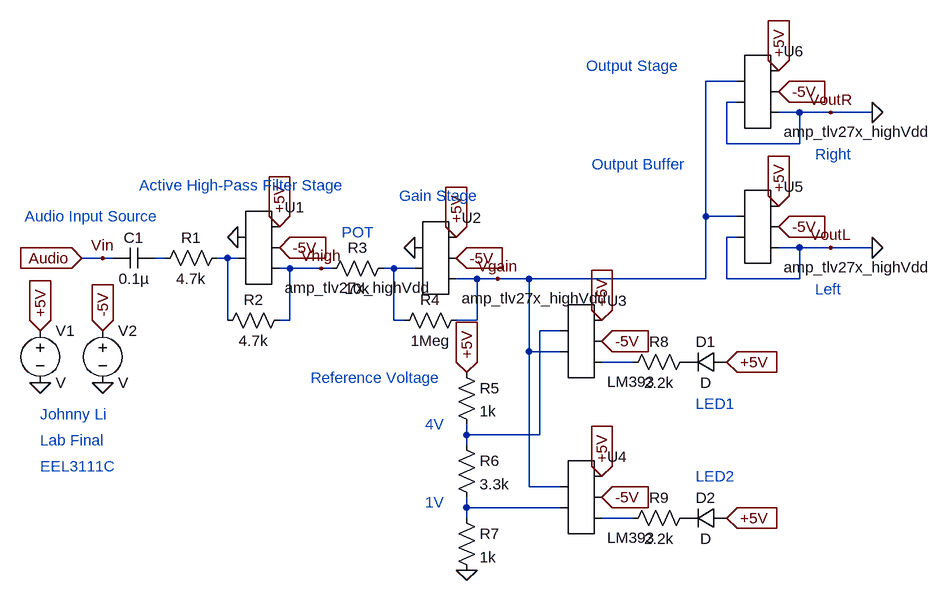
[diagram p0: schematic Lab Final.asc]
Lab Final.asc, the LTspice schematic file:
Version 4
SHEET 1 1588 680
WIRE 944 -192 896 -192
WIRE 944 -160 928 -160
WIRE 1040 -144 1008 -144
WIRE 1088 -144 1040 -144
WIRE 1152 -144 1088 -144
WIRE 928 -96 928 -160
WIRE 1040 -96 1040 -144
WIRE 1040 -96 928 -96
WIRE 896 16 896 -192
WIRE 944 16 896 16
WIRE 944 48 928 48
WIRE 1040 64 1008 64
WIRE 1088 64 1040 64
WIRE 1152 64 1088 64
WIRE -32 80 -64 80
WIRE -16 80 -32 80
WIRE 64 80 48 80
WIRE 160 80 144 80
WIRE 176 80 160 80
WIRE 256 96 240 96
WIRE 304 96 256 96
WIRE 320 96 304 96
WIRE 416 96 400 96
WIRE 448 96 416 96
WIRE 544 112 512 112
WIRE 576 112 544 112
WIRE 624 112 576 112
WIRE 896 112 896 16
WIRE 896 112 624 112
WIRE 928 112 928 48
WIRE 1040 112 1040 64
WIRE 1040 112 928 112
WIRE 160 176 160 80
WIRE 256 176 256 96
WIRE 256 176 240 176
WIRE 416 176 416 96
WIRE 432 176 416 176
WIRE 544 176 544 112
WIRE 544 176 512 176
WIRE 672 192 640 192
WIRE 624 224 624 112
WIRE 672 224 624 224
WIRE 784 240 736 240
WIRE 528 352 528 336
WIRE 640 352 640 192
WIRE 640 352 528 352
WIRE 528 368 528 352
WIRE 624 432 624 224
WIRE 672 432 624 432
WIRE 528 464 528 448
WIRE 672 464 528 464
WIRE 528 480 528 464
WIRE 784 480 736 480
FLAG -32 272 0
FLAG -128 272 0
FLAG -128 192 +5V
IOPIN -128 192 In
FLAG -32 192 -5V
IOPIN -32 192 In
FLAG -64 80 Audio
IOPIN -64 80 In
FLAG -32 80 Vin
FLAG 176 48 0
FLAG 736 416 +5V
IOPIN 736 416 In
FLAG 928 240 +5V
IOPIN 928 240 In
FLAG 736 176 +5V
IOPIN 736 176 In
FLAG 528 256 +5V
IOPIN 528 256 In
FLAG 512 48 +5V
IOPIN 512 48 In
FLAG 240 32 +5V
IOPIN 240 32 In
FLAG 736 448 -5V
IOPIN 736 448 In
FLAG 1008 0 +5V
IOPIN 1008 0 In
FLAG 1008 32 -5V
IOPIN 1008 32 In
FLAG 736 208 -5V
IOPIN 736 208 In
FLAG 512 80 -5V
IOPIN 512 80 In
FLAG 240 64 -5V
IOPIN 240 64 In
FLAG 304 96 Vhigh
FLAG 448 64 0
FLAG 576 112 Vgain
FLAG 528 560 0
FLAG 928 480 +5V
IOPIN 928 480 In
FLAG 1088 64 VoutL
FLAG 1152 64 0
FLAG 1008 -208 +5V
IOPIN 1008 -208 In
FLAG 1008 -176 -5V
IOPIN 1008 -176 In
FLAG 1088 -144 VoutR
FLAG 1152 -144 0
SYMBOL voltage -128 176 R0
SYMATTR InstName V1
SYMBOL voltage -32 176 R0
SYMATTR InstName V2
SYMBOL cap 48 64 R90
WINDOW 0 0 32 VBottom 2
WINDOW 3 32 32 VTop 2
SYMATTR InstName C1
SYMATTR Value 0.1µ
SYMBOL res 160 64 R90
WINDOW 0 0 56 VBottom 2
WINDOW 3 32 56 VTop 2
SYMATTR InstName R1
SYMATTR Value 4.7k
SYMBOL AutoGenerated\\amp_tlv27x_highVdd 208 64 R0
SYMATTR InstName U1
SYMBOL res 256 160 R90
WINDOW 0 0 56 VBottom 2
WINDOW 3 32 56 VTop 2
SYMATTR InstName R2
SYMATTR Value 4.7k
SYMBOL res 416 80 R90
WINDOW 0 0 56 VBottom 2
WINDOW 3 32 56 VTop 2
SYMATTR InstName R3
SYMATTR Value 10k
SYMBOL AutoGenerated\\amp_tlv27x_highVdd 480 80 R0
SYMATTR InstName U2
SYMBOL res 528 160 R90
WINDOW 0 0 56 VBottom 2
WINDOW 3 32 56 VTop 2
SYMATTR InstName R4
SYMATTR Value 1Meg
SYMBOL AutoGenerated\\LM393 704 208 R0
SYMATTR InstName U3
SYMBOL res 512 240 R0
SYMATTR InstName R5
SYMATTR Value 1k
SYMBOL res 512 352 R0
SYMATTR InstName R6
SYMATTR Value 3.3k
SYMBOL res 512 464 R0
SYMATTR InstName R7
SYMATTR Value 1k
SYMBOL res 880 224 R90
WINDOW 0 0 56 VBottom 2
WINDOW 3 32 56 VTop 2
SYMATTR InstName R8
SYMATTR Value 2.2k
SYMBOL diode 928 224 R90
WINDOW 0 0 32 VBottom 2
WINDOW 3 32 32 VTop 2
SYMATTR InstName D1
SYMBOL AutoGenerated\\LM393 704 448 R0
SYMATTR InstName U4
SYMBOL res 880 464 R90
WINDOW 0 0 56 VBottom 2
WINDOW 3 32 56 VTop 2
SYMATTR InstName R9
SYMATTR Value 2.2k
SYMBOL diode 928 464 R90
WINDOW 0 0 32 VBottom 2
WINDOW 3 32 32 VTop 2
SYMATTR InstName D2
SYMBOL AutoGenerated\\amp_tlv27x_highVdd 976 32 R0
SYMATTR InstName U5
SYMBOL AutoGenerated\\amp_tlv27x_highVdd 976 -176 R0
SYMATTR InstName U6
TEXT 336 40 Left 2 ;POT
TEXT -152 16 Left 2 ;Audio Input Source
TEXT 24 -32 Left 2 ;Active High-Pass Filter Stage
TEXT 424 -16 Left 2 ;Gain Stage
TEXT 288 264 Left 2 ;Reference Voltage
TEXT 464 336 Left 2 ;4V
TEXT 464 456 Left 2 ;1V
TEXT 880 304 Left 2 ;LED1
TEXT 880 416 Left 2 ;LED2
TEXT 712 -216 Left 2 ;Output Stage
TEXT 720 -64 Left 2 ;Output Buffer
TEXT 1064 -80 Left 2 ;Right
TEXT 1064 128 Left 2 ;Left
TEXT -128 320 Left 2 ;Johnny Li
TEXT -128 360 Left 2 ;Lab Final
TEXT -128 400 Left 2 ;EEL3111C

The netlist it stands for:
* Lab Final.asc
V1 +5V 0 V
V2 -5V 0 V
C1 N001 Vin 0.1µ
R1 N002 N001 4.7k
* U1: amp_tlv27x_highVdd (symbol AutoGenerated\amp_tlv27x_highVdd not available, pins judged from their places): pin1=0 pin2=N002 pin3=+5V pin4=-5V pin5=Vhigh
R2 Vhigh N002 4.7k
R3 N003 Vhigh 10k
* U2: amp_tlv27x_highVdd (symbol AutoGenerated\amp_tlv27x_highVdd not available, pins judged from their places): pin1=0 pin2=N003 pin3=+5V pin4=-5V pin5=Vgain
R4 Vgain N003 1Meg
* U3: LM393 (symbol AutoGenerated\LM393 not available, pins judged from their places): pin1=N004 pin2=Vgain pin3=+5V pin4=-5V pin5=N005
R5 +5V N004 1k
R6 N004 N006 3.3k
R7 N006 0 1k
R8 P001 N005 2.2k
D1 +5V P001 D
* U4: LM393 (symbol AutoGenerated\LM393 not available, pins judged from their places): pin1=Vgain pin2=N006 pin3=+5V pin4=-5V pin5=N007
R9 P002 N007 2.2k
D2 +5V P002 D
* U5: amp_tlv27x_highVdd (symbol AutoGenerated\amp_tlv27x_highVdd not available, pins judged from their places): pin1=Vgain pin2=0 pin3=+5V pin4=-5V pin5=0
* U6: amp_tlv27x_highVdd (symbol AutoGenerated\amp_tlv27x_highVdd not available, pins judged from their places): pin1=Vgain pin2=0 pin3=+5V pin4=-5V pin5=0
.model D D
.lib standard.dio
* POT
* Audio Input Source
* Active High-Pass Filter Stage
* Gain Stage
* Reference Voltage
* 4V
* 1V
* LED1
* LED2
* Output Stage
* Output Buffer
* Right
* Left
* Johnny Li
* Lab Final
* EEL3111C
.backanno
.end